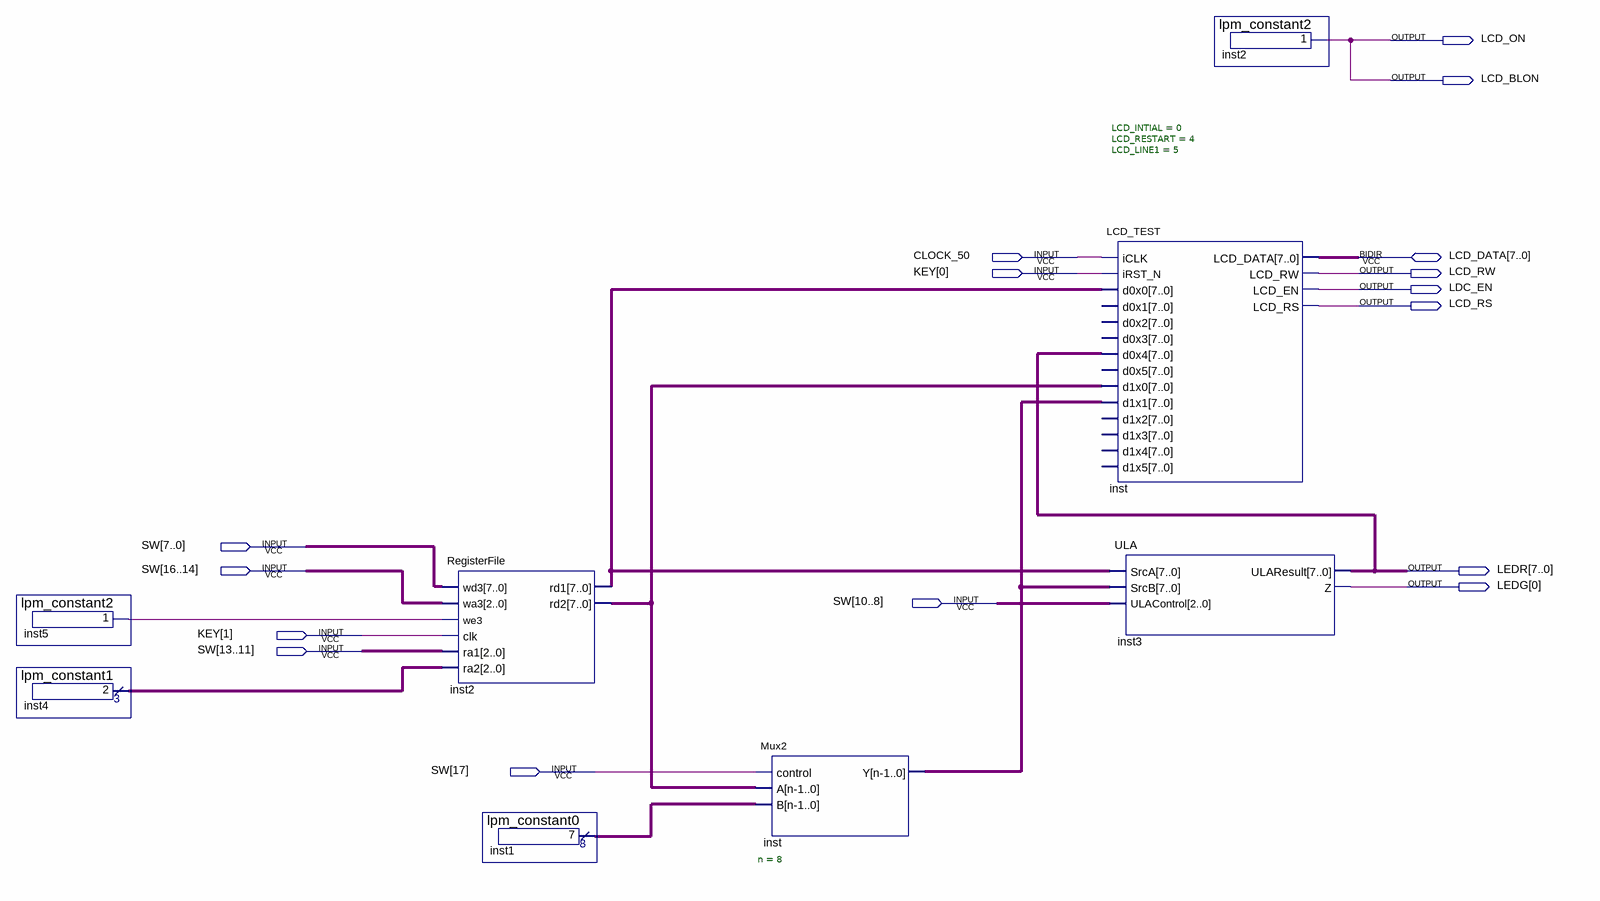
[diagram p0: schematic sheet]
// Quartus schematic sprint3.bdf as structural Verilog: 8 symbols, 16 pins
module sprint3 (
  input  CLOCK_50,
  input  [1:0] KEY,
  input  [17:0] SW,
  inout  [7:0] LCD_DATA,
  output LCD_ON,
  output LCD_BLON,
  output LCD_RW,
  output LDC_EN,
  output LCD_RS,
  output [7:0] LEDR,
  output [0:0] LEDG
);

  wire inst5_result;
  wire [2:0] inst4_result;
  wire [7:0] inst1_result, inst2_rd1, inst2_rd2, inst_y;

  lpm_constant2 inst5 (.result(inst5_result));
  lpm_constant1 inst4 (.result(inst4_result));
  RegisterFile inst2 (
    .wd3(SW[7:0]), .wa3(SW[16:14]), .we3(inst5_result), .clk(KEY[1]), .ra1(SW[13:11]), .ra2(inst4_result),
    .rd1(inst2_rd1), .rd2(inst2_rd2));
  lpm_constant0 inst1 (.result(inst1_result));
  Mux2 #(.n(8)) inst (.control(SW[17]), .A(inst2_rd2), .B(inst1_result), .Y(inst_y));
  LCD_TEST #(.LCD_INTIAL(0), .LCD_RESTART(4), .LCD_LINE1(5)) inst_dup2 (
    .iCLK(CLOCK_50), .iRST_N(KEY[0]), .d0x0(inst2_rd1), .d0x4(LEDR), .d1x0(inst2_rd2), .d1x1(inst_y),
    .LCD_DATA(LCD_DATA), .LCD_RW(LCD_RW), .LCD_EN(LDC_EN), .LCD_RS(LCD_RS));  // open: d0x1, d0x2, d0x3, d0x5, d1x2, d1x3, d1x4, d1x5
  ULA inst3 (.SrcA(inst2_rd1), .SrcB(inst_y), .ULAControl(SW[10:8]), .ULAResult(LEDR), .Z(LEDG[0]));
  lpm_constant2 inst2_dup2 (.result(LCD_BLON));

  assign LCD_ON = LCD_BLON;
endmodule
